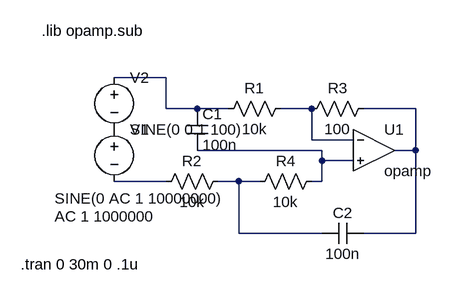
[diagram p0: schematic Heterodyne.asc]
Heterodyne.asc, the LTspice schematic file:
Version 4
SHEET 1 880 680
WIRE 160 128 80 128
WIRE 160 176 160 128
WIRE 208 176 160 176
WIRE 256 176 208 176
WIRE 384 176 336 176
WIRE 544 176 464 176
WIRE 384 224 384 176
WIRE 448 224 384 224
WIRE 400 240 208 240
WIRE 544 240 544 176
WIRE 544 240 512 240
WIRE 400 256 400 240
WIRE 448 256 400 256
WIRE 160 288 80 288
WIRE 272 288 240 288
WIRE 304 288 272 288
WIRE 400 288 400 256
WIRE 400 288 384 288
WIRE 272 368 272 288
WIRE 400 368 272 368
WIRE 544 368 544 240
WIRE 544 368 464 368
SYMBOL voltage 80 192 R0
WINDOW 3 -92 122 Left 2
WINDOW 123 -92 150 Left 2
WINDOW 39 0 0 Left 0
SYMATTR InstName V1
SYMATTR Value SINE(0 AC 1 10000000)
SYMATTR Value2 AC 1 1000000
SYMBOL res 352 160 R90
WINDOW 0 0 56 VBottom 2
WINDOW 3 32 56 VTop 2
SYMATTR InstName R1
SYMATTR Value 10k
SYMBOL res 256 272 R90
WINDOW 0 0 56 VBottom 2
WINDOW 3 32 56 VTop 2
SYMATTR InstName R2
SYMATTR Value 10k
SYMBOL res 480 160 R90
WINDOW 0 0 56 VBottom 2
WINDOW 3 32 56 VTop 2
SYMATTR InstName R3
SYMATTR Value 100
SYMBOL cap 192 176 R0
SYMATTR InstName C1
SYMATTR Value 100n
SYMBOL res 400 272 R90
WINDOW 0 0 56 VBottom 2
WINDOW 3 32 56 VTop 2
SYMATTR InstName R4
SYMATTR Value 10k
SYMBOL cap 464 352 R90
WINDOW 0 0 32 VBottom 2
WINDOW 3 32 32 VTop 2
SYMATTR InstName C2
SYMATTR Value 100n
SYMBOL Opamps\\opamp 480 176 R0
SYMATTR InstName U1
SYMBOL voltage 80 112 R0
WINDOW 123 0 0 Left 0
WINDOW 39 0 0 Left 0
SYMATTR InstName V2
SYMATTR Value SINE(0 0.1 100)
TEXT -32 56 Left 2 !.lib opamp.sub
TEXT -64 416 Left 2 !.tran 0 30m 0 .1u

The netlist it stands for:
* Heterodyne.asc
V1 P001 N005 SINE(0 AC 1 10000000) AC 1 1000000
R1 N002 N001 10k
R2 N006 N005 10k
R3 N003 N002 100
C1 N001 N004 100n
R4 N004 N006 10k
C2 N003 N006 100n
XU1 N002 N004 N003 opamp Aol=100K GBW=10Meg  ; pins invin noninvin out
V2 N001 P001 SINE(0 0.1 100)
.lib opamp.sub
.tran 0 30m 0 .1u
.backanno
.end